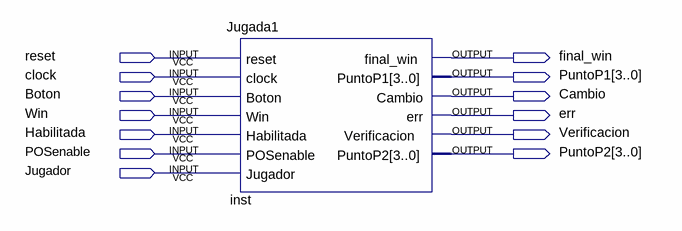
[diagram p0: schematic sheet]
// Quartus schematic BloqueJugada1.bdf as structural Verilog: 1 symbols, 13 pins
module BloqueJugada1 (
  input  reset,
  input  clock,
  input  Boton,
  input  Win,
  input  Habilitada,
  input  POSenable,
  input  Jugador,
  output final_win,
  output [3:0] PuntoP1,
  output Cambio,
  output err,
  output Verificacion,
  output [3:0] PuntoP2
);

  Jugada1 inst (
    .reset(reset), .clock(clock), .Boton(Boton), .Win(Win), .Habilitada(Habilitada), .POSenable(POSenable),
    .Jugador(Jugador), .final_win(final_win), .PuntoP1(PuntoP1), .Cambio(Cambio), .err(err),
    .Verificacion(Verificacion), .PuntoP2(PuntoP2));
endmodule
